# Altium schematic sheet Power.SchDoc
size B; SheetNumber: 2; SheetTotal: 8
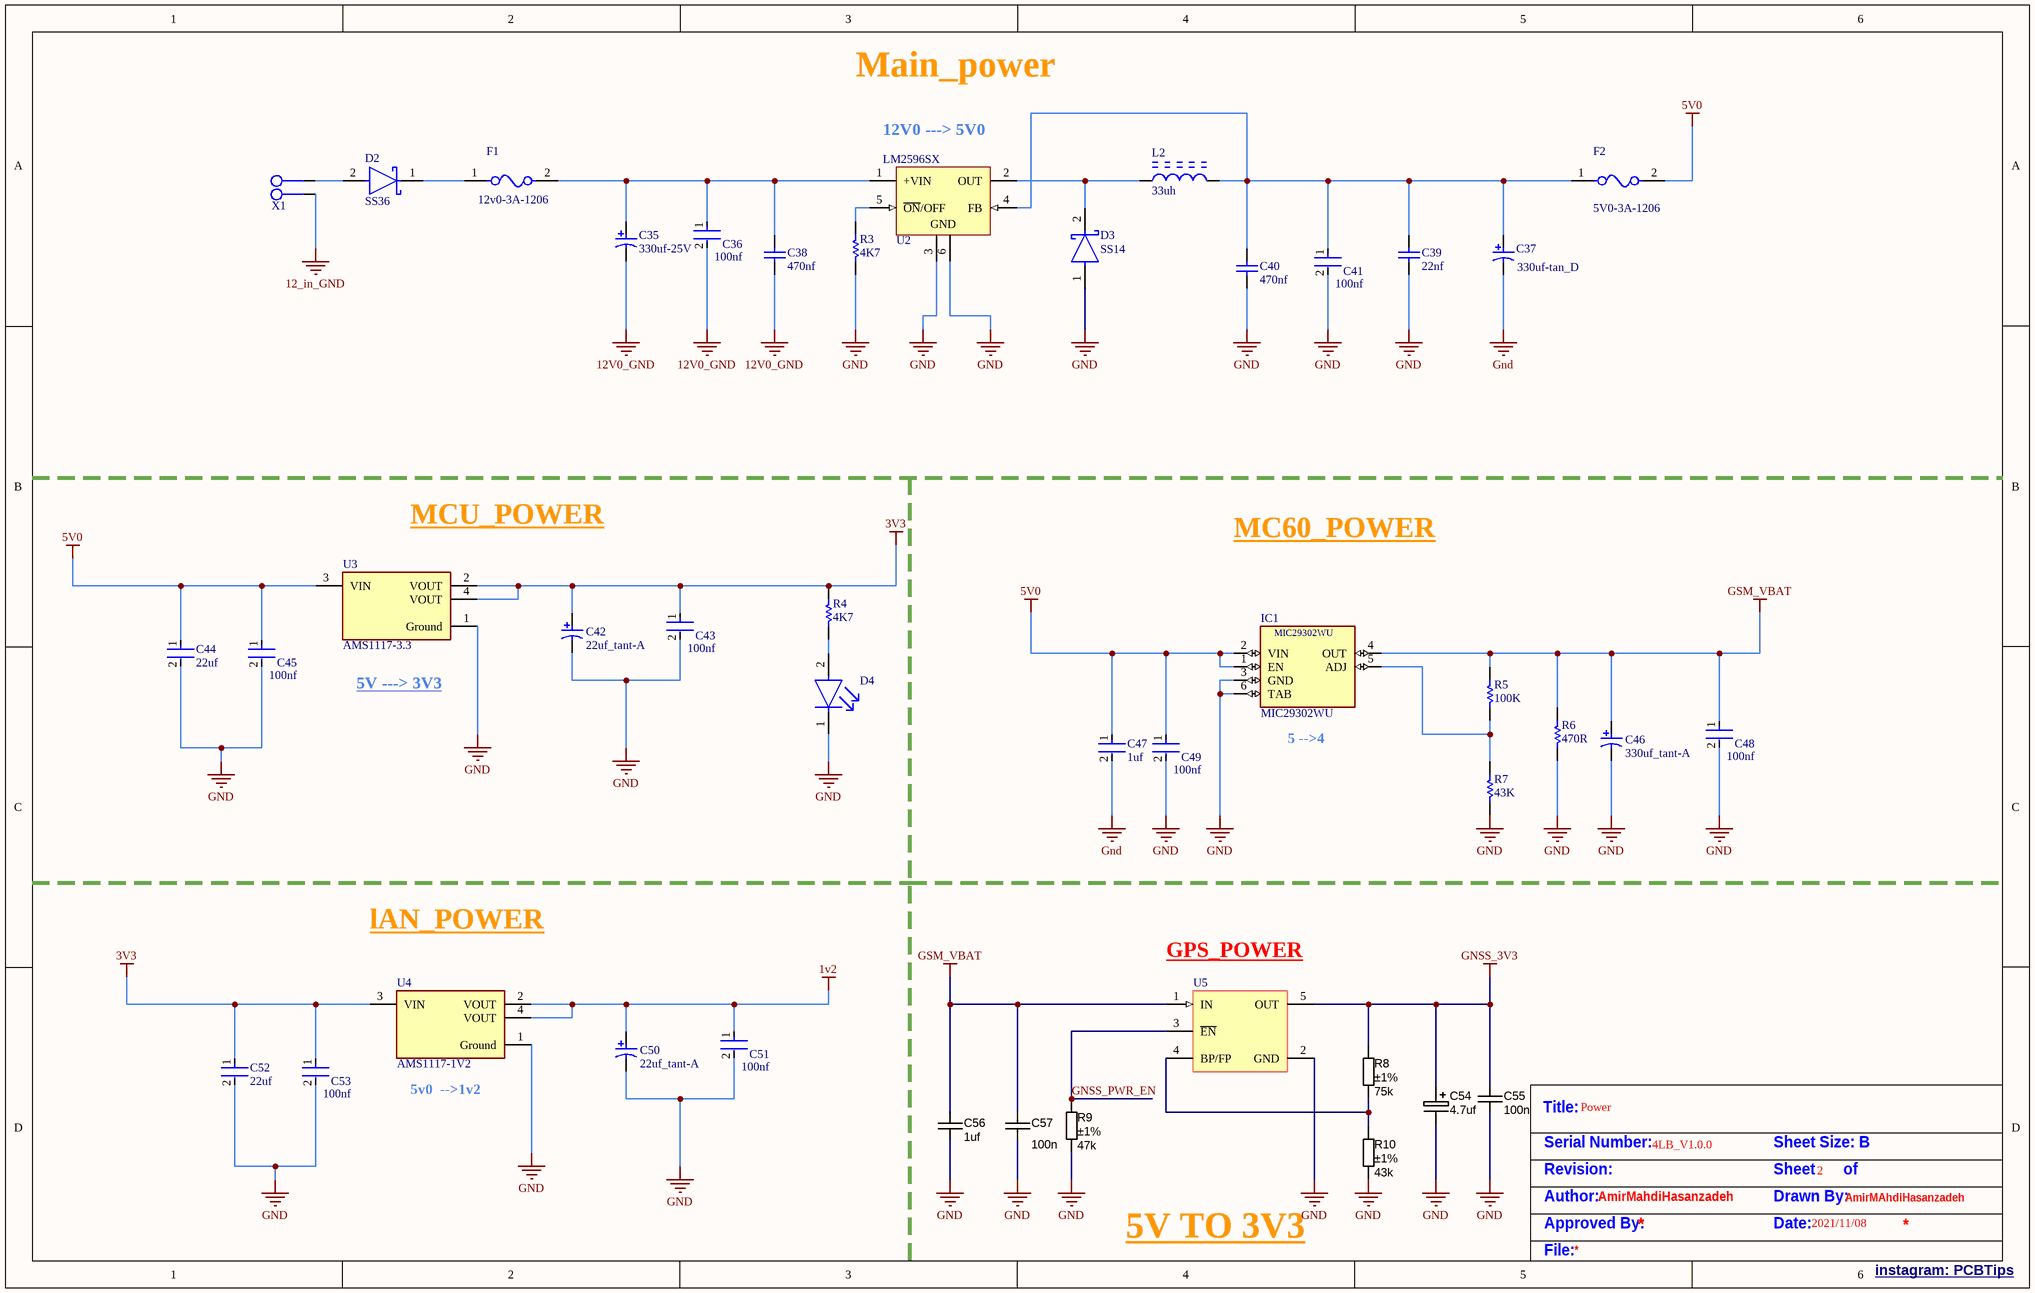
[diagram p0: Power.SchDoc]

## Parts
C35  330uf-25V  [NIC-CAPA2-8X10_V]
C36  100nf  [FP-CGA3E-0_3-0_1-IPC_A]
C37  330uf-tan_D  [CAPMP7344X31-T_V]
C38  470nf  [CAPC3216X125X55LL15T25]
C39  22nf  [CAPC1608X90X35ML10T15]
C40  470nf  [CAPC3216X125X55LL15T25]
C41  100nf  [FP-CGA3E-0_3-0_1-IPC_A]
C42  22uf_tant-A  [AVX-TPSA106K010R1800_M]
C43  100nf  [FP-CGA3E-0_3-0_1-IPC_A]
C44  22uf  [FP-GRM31C-0_2-e0_3_0_8-MFG]
C45  100nf  [FP-CGA3E-0_3-0_1-IPC_A]
C46  330uf_tant-A  [AVX-TPSA106K010R1800_M]
C47  1uf  [FP-0603-L_1_6_0_1-W_0_8_0-IPC_A]
C48  100nf  [FP-CGA3E-0_3-0_1-IPC_A]
C49  100nf  [FP-CGA3E-0_3-0_1-IPC_A]
C50  22uf_tant-A  [AVX-TPSA106K010R1800_M]
C51  100nf  [FP-CGA3E-0_3-0_1-IPC_A]
C52  22uf  [FP-GRM31C-0_2-e0_3_0_8-MFG]
C53  100nf  [FP-CGA3E-0_3-0_1-IPC_A]
C54  4.7uf  [C_TN_3216]
C55  value 100n  [CAPC1608X90N]  (hidden comment: approved sub OK)
C56  1uf  [CAPC1608X90N]
C57  100n  [CAPC1608X90N]
D2  SS36  [FP-403AG-MFG]
D3  SS14  [FP-403AE-MFG]
D4  LTST-C191TBKT  [FP-LTST-C191TBKT-MFG]  (value not drawn)
F1  12v0-3A-1206  [FP-nanoSMDC-MFG]
F2  5V0-3A-1206  [FP-nanoSMDC-MFG]
IC1  MIC29302WU  [TO263-5]
L2  33uh  [BOUR-SRR1280-2_V]
R3  4K7  [RESC1608X55X25ML10T15]
R4  4K7  [RESC1608X55X25ML10T15]
R5  100K  [RESC1608X55X25ML10T15]
R6  470R  [RESC1608X55X25ML10T15]
R7  43K  [RESC1608X55X25ML10T15]
R8  value 75k  Tolerance: ±1%  [RESC1608X55N]  (hidden comment: Thick Film)
R9  value 47k  Tolerance: ±1%  [RESC1608X55N]  (hidden comment: Thick Film)
R10  value 43k  Tolerance: ±1%  [RESC1608X55N]  (hidden comment: Thick Film)
U2  LM2596SX  [KTT0005B_L]
U3  AMS1117-3.3  [FP-AMS1117-IPC_C]
U4  AMS1117-1V2  [FP-AMS1117-IPC_C]
U5  (no value)  [SOT95P280X100-5N]
X1  Phoenix MKDSN 02  [GMSTB762_2]  (value not drawn)

## Nets
1v2: C50.1 C51.1 U4.2(VOUT) U4.4(VOUT)
3V3: C42.1 C43.1 C52.1 C53.1 R4.2 U3.2(VOUT) U3.4(VOUT) U4.3(VIN)
5V0: C44.1 C45.1 C47.1 C49.1 F2.2 IC1.1(EN) IC1.2(VIN) U3.3(VIN)
12_in_GND: X1.1
12V0_GND: C35.2 C36.2 C38.1
GND: C37.2 C39.1 C40.1 C41.2 C42.2 C43.2 C44.2 C45.2 C46.2 C47.2 C48.2 C49.2 C50.2 C51.2 C52.2 C53.2 C54.2 C55.2 C56.2 C57.2 D3.1(A) D4.1(C) IC1.3(GND) IC1.6(TAB) R3.1 R6.1 R7.1 R9.2 R10.2 U2.3(GND) U2.6(GND) U3.1(Ground) U4.1(Ground) U5.2(GND)
GNSS_3V3: C54.1 C55.1 R8.1 U5.5(OUT)
GSM_VBAT: C46.1 C48.1 C56.1 C57.1 IC1.4(OUT) R5.2 R6.2 U5.1(IN)
GNSS_PWR_EN: R9.1 U5.3(~{EN})
NetC35_1: C35.1 C36.1 C38.2 F1.2 U2.1(+VIN)
NetC37_1: C37.1 C39.2 C40.2 C41.1 F2.1 L2.2 U2.4(FB)
NetD2_1: D2.1(C) F1.1
NetD2_2: D2.2(A) X1.2
NetD3_2: D3.2(C) L2.1 U2.2(OUT)
NetD4_2: D4.2(A) R4.1
NetIC1_5: IC1.5(ADJ) R5.1 R7.2
NetR3_2: R3.2 U2.5(~{ON}/OFF)
NetR8_2: R8.2 R10.1 U5.4(BP/FP)

## Notes on the sheet
- Main_power
- (near U2) 12V0 ---> 5V0
- MCU_POWER
- MC60_POWER
- (near U3) 5V ---> 3V3
- (near IC1) 5 -->4
- lAN_POWER
- (near U5) GPS_POWER
- (near U4) 5v0  -->1v2
- 5V TO 3V3
- Title:
- Power
- Serial Number:
- Revision:
- 4LB_V1.0.0
- Sheet       of
- Sheet Size: B
- 2
- Author:
- Approved By:
- AmirMahdiHasanzadeh
- Date:
- Drawn By:
- 2021/11/08
- AmirMAhdiHasanzadeh
- File:
- instagram: PCBTips <https://www.instagram.com/pcbtips>

## Library data of the parts
C35 = CMP-0687-00068-1: Aluminum Electrolytic Capacitor, UD Series, Low Impedance, 330 uF, 25 V, + / - 20%, -55 to 105 degC, Chip Type, 8 x 10 mm D x L, Pb-Free, Reel; PartNumber: UUD1E331MNL1GS; Manufacturer: Nichicon; Rated Voltage: 25 V; Tolerance Rated Capacitance: -20 to 20%; Packing: Dia382mm Reel; Impedance: 0.17 Ohm; Rated Ripple Current (at 100kHz): 450 mA; Endurance Time: 5000 h; Rated Capacitance: 330 uF; ComponentLink3URL: http://products.nichicon.co.jp/en/pdf/XJA043/e-ud.pdf; PackageDescription: 2-Pin Surface Mount Device, Diameter 8 mm, Height 10 mm, Pitch 6.5 mm; ComponentLink1URL: http://www.nichicon.co.jp/; PackageReference: CAPAE-D8H10; ComponentLink1Description: Manufacturer URL; ComponentLink2Description: Datasheet; DatasheetVersion: 08/2012; RoHS: TRUE; Diameter: 8 mm; Mounting Technology: Surface Mount; ComponentLink2URL: http://products.nichicon.co.jp/en/pdf/XJA043/e-ud.pdf; ComponentLink3Description: Package Specification; Length: 10 mm
C36 C41 C43 C45 C48 C49 C51 C53 = CMP-2000-07546-2: Cap Ceramic 100nF 50V X7R 10% Pad SMD 0603 +125°C Automotive T/R; Weight: 7.1E-05oz; Composition: Ceramic; Max Operating Temperature: 125°C; Termination: SMD/SMT; Dielectric: X7R; Length: 1.6mm; Package Quantity: 1; REACH SVHC: No SVHC; Lead Free: Lead Free; Case Code (Metric): 1608; Min Operating Temperature: -55°C; Packaging: Tape and Reel; Tolerance: 10%; Voltage Rating: 50V; Case Code (Imperial): 0603; Capacitance: 100nF; Case/Package: 0603; Voltage Rating (DC): 50V; Depth: 0.8mm; Radiation Hardening: No; Ratings: AEC-Q200; Mount: Surface Mount; Voltage: 50V; Thickness: 0.035inch; Width: 0.8mm; Height: 0.8mm
C37 = CMP-2000-07305-1: Low ESR, 330 uF, 6.3 V, +/- 10%, -55 to 125 degC, 2-Pin SMD, RoHS, Tape and Reel; Manufacturer: AVX; Rad Hardened: No; DF: 8%; Capacitance: 330000000pF; Product Depth (mm): 4.3mm; Wire Form: NotRequired; Lead Spacing (nom): NotRequiredmm; Case Style: Molded; Product Length (mm): 7.3mm; Voltage: 6.3VDC; DCL: 20.8uA; ESR: 0.05ohm; Product Height (mm): 2.9mm; Polarity: Polar; Datasheet URL: http://datasheets.avx.com/TPS.pdf; Mounting Style: SurfaceMount; Length W/Weld (max): NotRequiredmm; Construction: SMTChip; Package / Case: 7343-31; Product Diameter (mm): NotRequiredmm; Mounting Technology: SurfaceMount; Insulation: NotRequired; Operating Temp Range: -55Cto125C; Tolerance (+ or -): 10%; Failure Rate: NotRequired; Package URL: http://www.avx.com/download/software/literature/AVX-Footprint-Library.pdf; Packaging: TapeandReel; Case Code: D; Length W/Weld: NotRequiredmm; Manufacturer URL: http://www.avx.com/; Datasheet Version: 01/2017; Package Reference: CAPMP7344X31-T; Seated Plane Height: NotRequiredmm; Seal: NotRequired; Package Description: 2-Pin Surface Mount Device, Body 7.3 x 4.35 mm
C38 C40 = CMP-1037-04569-2: Chip Capacitor, 0.47 uF, +/- 10%, 50 V, -55 to 125 degC, 1206 (3216 Metric), RoHS, Tape and Reel; Manufacturer: Murata; Voltage Rating: 50V; Capacitance: 0.47uF; Case Height: 1.15mm; Temperature Coefficient / Code: +/-15%; Case Length: 3.2mm; Type: GeneralPurposeMLCC; Case Width: 1.6mm; Dielectric: X7R; Brand: MurataElectronics; Capacitance - pF: 470000pF; Dimensions: 1.6mmWx3.2mmLx1.15mmH; Product: GeneralTypeMLCCs; Minimum Operating Temperature: -55C; Packaging: Reel; Case Code - in: 1206; Package Reference: 1206; Tolerance: 10%; Case Code - mm: 3216; RoHS: Details; Series: GRM; Termination Style: SMD/SMT; Datasheet URL: http://psearch.en.murata.com/capacitor/product/GRM31MR71H474KA01%23.pdf?graph=c1f26abc89b3cfcebdb62922f5769d77; Capacitance - nF: 470nF; Voltage Rating DC: 50V; Product Category: MultilayerCeramicCapacitorsMLCC-SMD/SMT; Datasheet Version: 10/2016; Package / Case: 1206(3216metric); Maximum Operating Temperature: +125C; Mounting Technology: SurfaceMount; Operating Temperature Range: -55Cto+125C; Factory Pack Quantity: 3000; Manufacturer URL: http://www.murata.com/; Package Description: 2-Pin Surface Mount Device, Body 3.2 x 1.6 mm
C39 = CMP-2006-02910-1: Manufacturer: Murata; Part Number: GRM188R71H223KA01D
C42 C50 = CMP-2000-07288-1: Tantalum Capacitor, 22uF, +/- 10%, 10 V, -55 to 125 degC, 2-Pin Molded, RoHS, Tape and Reel; Manufacturer: AVX; Manufacturer Size Code: A; Online Catalog: TPSSeries; Other Names: 478-3317-1; Kits: 478-3444-ND-KITTANTCAPTPSSERIES; ESR (Equivalent Series Resistance): 1.8Ohm; Catalog Drawings: TPSSeriesSides; Product Training Modules: ComponentSolutionsforSmartMeterApplications; Voltage - Rated: 10V; EDA / CAD Models: DownloadfromAcceleratedDesigns; Featured Product: TPSCapacitors; Capacitance: 10µF; Mounting Type: SurfaceMount; Packaging: CutTape(CT); Package Reference: TPSA106K010R1800; Size / Dimension: 0.126"Lx0.063"W(3.20mmx1.60mm); Package / Case: 1206(3216Metric); Mounting Technology: SurfaceMount; Family: TantalumCapacitors; Manufacturer URL: http://www.avx.com/; Datasheet URL: http://www.farnell.com/datasheets/1441576.pdf; Datasheet Version: 03/2011; Height - Seated (Max): 0.071"(1.80mm); Type: Molded; Features: GeneralPurpose; Lifetime @ Temp.: -; Lead Spacing: -; Standard Package: 1; Package Description: 2-Pin Surface Mount Device, Body 3.2 x 1.65 mm; Tolerance: ±10%; Category: Capacitors; Operating Temperature: -55°C~125°C; Series: TPS
C44 C52 = CMP-06035-003841-1: Chip Multilayer Ceramic Capacitors for General Purpose, 1206, 22uF, X7R, 15%, 10%, 10V; Height: 1.6mm; Width: 0.063inch; Min Operating Temperature: -55°C; Package Quantity: 1; Termination: SMD/SMT; Length: 3.2mm; Voltage Rating: 10V; Case/Package: 1206; Capacitance: 22uF; Case Code (Imperial): 1206; Depth: 1.6mm; Dielectric: X7R; Voltage: 10V; Material: Ceramic; Tolerance: 10%; Voltage Rating (DC): 10V; Lead Free: Lead Free; Max Operating Temperature: 125°C; Case Code (Metric): 3216; Packaging: Tape and Reel; Thickness: 0.071inch; Radiation Hardening: No; REACH SVHC: No SVHC; Mount: Surface Mount
C46 = CMP-2000-07288-1: Tantalum Capacitor, 330uF, +/- 10%, 10 V, -55 to 125 degC, 2-Pin Molded, RoHS, Tape and Reel; Manufacturer: AVX; Manufacturer Size Code: A; Online Catalog: TPSSeries; Other Names: 478-3317-1; Kits: 478-3444-ND-KITTANTCAPTPSSERIES; ESR (Equivalent Series Resistance): 1.8Ohm; Catalog Drawings: TPSSeriesSides; Product Training Modules: ComponentSolutionsforSmartMeterApplications; Voltage - Rated: 10V; EDA / CAD Models: DownloadfromAcceleratedDesigns; Featured Product: TPSCapacitors; Capacitance: 10µF; Mounting Type: SurfaceMount; Packaging: CutTape(CT); Package Reference: TPSA106K010R1800; Size / Dimension: 0.126"Lx0.063"W(3.20mmx1.60mm); Package / Case: 1206(3216Metric); Mounting Technology: SurfaceMount; Family: TantalumCapacitors; Manufacturer URL: http://www.avx.com/; Datasheet URL: http://www.farnell.com/datasheets/1441576.pdf; Datasheet Version: 03/2011; Height - Seated (Max): 0.071"(1.80mm); Type: Molded; Features: GeneralPurpose; Lifetime @ Temp.: -; Lead Spacing: -; Standard Package: 1; Package Description: 2-Pin Surface Mount Device, Body 3.2 x 1.65 mm; Tolerance: ±10%; Category: Capacitors; Operating Temperature: -55°C~125°C; Series: TPS
C47 = CMP-2000-05447-3: None; Tolerance: 10%; Voltage Rating: 50V; Dielectric: X5R; Height: 0.8mm; Depth: 0.8mm; Number of Pins: 2; Length: 1.6mm; Thickness: 0.035inch; Contact Plating: Nickel; Radiation Hardening: No; Package Quantity: 1; Case/Package: 0603; Capacitance: 1uF; Halogen Free: Halogen Free; RoHS Compliant: Yes; Termination: SMD/SMT; Max Operating Temperature: 85°C; Min Operating Temperature: -55°C; Case Code (Metric): 1608; Construction: Flat; Voltage Rating (DC): 50V; Packaging: Tape and Reel; Series: M; Case Code (Imperial): 0603; Width: 0.031inch; Mount: Surface Mount
C54 = CAPT_330u_2917_6V3: Capacitor SMD Tant 4.7uF 20% 6V3 2917; Manufacturer Size Code: D; Manufacturer Part Number: T520D337M006ATE015; Ratings: 6.3V; Material: Solid Tantalum; ESR (Equivalent Series Resistance): 15 mOhm; SCDType: spec; Package / Case: 2917 (7343 Metric); Tolerance: ±20%; Operating Temperature: -55°C ~ 125°C; Size / Dimension: 0.287" L x 0.169" W (7.30mm x 4.30mm); Height - Seated (Max): 0.122" (3.10mm); Supplier 1: Digi-Key; Supplier Part Number 1: 399-4052-1-ND; ComponentLink1URL: http://www.kemet.com/datasheets&T520D337M006ATE015; ComponentLink1Description: T520D Datasheet; Value: 4.7uf
C55 = CAPC_100n_0603_X7R_50V_10%: Capacitor SMD Cer 100nF 10% 50V X7R 0603; Manufacturer 1: AVX Corporation; Manufacturer Part Number 1: 06035C104KAT2A; Ratings: 50V; X7R; Material: ceramic; SCDType: spec; Manufacturer 2: TDK Corporation; Manufacturer Part Number 2: C1608X7R1H104K; Package / Case: 0603 (1608 Metric); Tolerance: ±10%; Supplier 1: Digi-Key; Supplier Part Number 1: 478-5052-1-ND; ComponentLink1URL: http://www.avx.com/docs/Catalogs/cx7r.pdf; ComponentLink1Description: http://www.avx.com/docs/Catalogs/cx7r.pdf; Supplier 2: Digi-Key; Supplier Part Number 2: 445-1314-1-ND; ComponentLink2URL: http://product.tdk.com/capacitor/mlcc/en/documents/mlcc_commercial_general_en.pdf; ComponentLink2Description: http://product.tdk.com/capacitor/mlcc/en/documents/mlcc_commercial_general_en.pdf
C56 = CAPC_470n_0603_X7R_16V_10%: Capacitor SMD Cer 1uf 10% 16V X7R 0603; Manufacturer 1: Murata Electronics North America; Manufacturer Part Number 1: GRM188R71C474KA88D; Ratings: 16V; X7R; Material: ceramic; SCDType: spec; Package / Case: 0603 (1608 metric); Tolerance: ±10%; Manufacturer 2: TDK Corporation; Manufacturer Part Number 2: C1608X7R1C474K; Supplier 1: Digi-Key; Supplier Part Number 1: 490-3295-2-ND; Supplier 2: Digi-Key; Supplier Part Number 2: 445-5192-2-ND; Supplier 3: Digi-Key; Supplier Part Number 3: 587-1250-2-ND; Manufacturer 3: Taiyo Yuden; Manufacturer Part Number 3: EMK107B7474KA-T; Manufacturer 4: Samsung; Manufacturer Part Number 4: CL10B474KONE; ComponentLink1URL: http://psearch.murata.com/capacitor/product/GRM188R71C474KA88#.pdf; ComponentLink1Description: http://psearch.murata.com/capacitor/product/GRM188R71C474KA88#.pdf; ComponentLink2URL: http://product.tdk.com/capacitor/mlcc/en/documents/mlcc_commercial_general_en.pdf; ComponentLink2Description: http://product.tdk.com/capacitor/mlcc/en/documents/mlcc_commercial_general_en.pdf; ComponentLink3URL: http://www.yuden.co.jp/or/product/category/capacitor/EMK107B7474KA-T.pdf; ComponentLink3Description: http://www.yuden.co.jp/or/product/category/capacitor/EMK107B7474KA-T.pdf; Value: 1uf
C57 = CAPC_470n_0603_X7R_16V_10%: Capacitor SMD Cer 100nF 10% 16V X7R 0603; Manufacturer 1: Murata Electronics North America; Manufacturer Part Number 1: GRM188R71C474KA88D; Ratings: 16V; X7R; Material: ceramic; SCDType: spec; Package / Case: 0603 (1608 metric); Tolerance: ±10%; Manufacturer 2: TDK Corporation; Manufacturer Part Number 2: C1608X7R1C474K; Supplier 1: Digi-Key; Supplier Part Number 1: 490-3295-2-ND; Supplier 2: Digi-Key; Supplier Part Number 2: 445-5192-2-ND; Supplier 3: Digi-Key; Supplier Part Number 3: 587-1250-2-ND; Manufacturer 3: Taiyo Yuden; Manufacturer Part Number 3: EMK107B7474KA-T; Manufacturer 4: Samsung; Manufacturer Part Number 4: CL10B474KONE; ComponentLink1URL: http://psearch.murata.com/capacitor/product/GRM188R71C474KA88#.pdf; ComponentLink1Description: http://psearch.murata.com/capacitor/product/GRM188R71C474KA88#.pdf; ComponentLink2URL: http://product.tdk.com/capacitor/mlcc/en/documents/mlcc_commercial_general_en.pdf; ComponentLink2Description: http://product.tdk.com/capacitor/mlcc/en/documents/mlcc_commercial_general_en.pdf; ComponentLink3URL: http://www.yuden.co.jp/or/product/category/capacitor/EMK107B7474KA-T.pdf; ComponentLink3Description: http://www.yuden.co.jp/or/product/category/capacitor/EMK107B7474KA-T.pdf; Value: 100n
D2 = CMP-07162-000004-1: DIODE SCHOTTKY 60V 3A SMC; Manufacturer: ON Semiconductor; Max Junction Temp: +150°C; Max Surge Forward Current: 100A; Standoff Height: 0.05mm; Peak Reverse Current: 0.5mA; Manufacturer Part Number: SS36; Category: Diode; Device Class L2: Diodes; Lead Free: Yes; Mouser Description: In a Pack of 25, ON Semi 60V 3A, Schottky Diode, 2-Pin DO-214AB SS36; Automotive: No; Package: 403AG; Device Class L3: Schottky Diodes; Footprint Url: https://www.onsemi.com/pub/Collateral/403AG.PDF; Temperature: -55°C to +150°C; ComponentLink2URL: https://www.onsemi.com/pub/Collateral/SS39-D.PDF; Max Repetitive Reverse Voltage: 60V; Octopart: https://octopart.com/ss36-on+semiconductor-84331627; Temperature Range Low: -55°C; Forward Current: 3A; Device Class L1: Discrete Semiconductors; Digikey Description: DIODE SCHOTTKY 60V 3A SMC; RoHS: TRUE; Temperature Range High: +150°C; ComponentLink2Description: Datasheet; Height: 2.65mm
D3 = CMP-2000-04943-2: DIODE SCHOTTKY 40V 1A SMA; Manufacturer: ON Semiconductor; Peak Reverse Current: 0.2mA; Max Junction Temp: +125°C; Standoff Height: 0.05mm; Max Surge Forward Current: 40A; Mouser Description: Schottky Diodes & Rectifiers SMA 40V 1.0A; RoHS: TRUE; Lead Free: Yes; Manufacturer Part Number: SS14; Device Class L3: Schottky Diodes; Category: Diode; Automotive: No; Digikey Description: DIODE SCHOTTKY 40V 1A SMA; ComponentLink2Description: Datasheet; Device Class L2: Diodes; Height: 2.5mm; Temperature Range High: +125°C; ComponentLink2URL: https://www.onsemi.com/pub/Collateral/SS19-D.PDF; Device Class L1: Discrete Semiconductors; Package: 403AE; Octopart: https://octopart.com/ss14-on+semiconductor-29205033; Max Repetitive Reverse Voltage: 40V; Temperature Range Low: -65°C; Forward Current: 1A; Temperature: -65°C to +125°C
D4 = CMP-22017-000008-1: LED BLUE CLEAR CHIP SMD; Lens Color: Colorless; Dominant Wavelength: 475nm; Forward Current: 20mA; Wavelength: 468nm; Viewing Angle: 130°; Power Dissipation: 76mW; Luminous Intensity: 180mcd; Reverse Voltage: 5V; Number of Elements: 1; Lens Style: Diffused; Forward Voltage: 3.8V; Max Power Dissipation: 75mW; Case Code (Metric): 1608; Packaging: Tape and Reel; Case/Package: 0603; Depth: 1.6mm; Mount: Surface Mount; Lead Free: Lead Free; Min Operating Temperature: -20°C; Lens Transparency: Clear; Illumination Color: Blue; Height: 0.55mm; Test Current: 20mA; Case Code (Imperial): 0603; Max Operating Temperature: 80°C; Number of Pins: 2; Length: 0.8mm; Radiation Hardening: No; Package Quantity: 1; Number of LEDs: 1; Width: 0.8mm; Color: Blue
F1 F2 = CMP-08606-000049-1: PTC RESET FUSE 48V 120MA 1206; Manufacturer: Littelfuse; Manufacturer Part Number: NANOSMDC012F-2; Trip Current: 0.39A; Resistance: 1.4-6.5Ω; Value: 1.4-6.5Ω; Current Rating: 10A; Hold Current: 0.12A; Trip Time: 0.2s; Category: Fuse; Device Class L2: PTC Resettable Fuses; ComponentLink2Description: Datasheet; Automotive: No; Package: nanoSMDC; Ambient Temperature Range Low: -40°C; Lead Free: Yes; Voltage Rating: 48V; Mouser Description: PTC Resettable Fuse 0.12A(hold) 0.39A(trip) 48VDC 10A 0.5W 0.2s 1.4Ohm SMD Solder Pad 1206 T/R Automotive; Octopart: https://octopart.com/nanosmdc012f-2-littelfuse-74215047; Device Class L1: Circuit Protection; Temperature Range High: +85°C; ComponentLink2URL: https://www.littelfuse.com/~/media/electronics/datasheets/resettable_ptcs/littelfuse_ptc_nanosmdc_datasheet.pdf.pdf; Temperature: to +85°C; Height: 1mm; Ambient Temperature Range High: +85°C; Digikey Description: PTC RESET FUSE 48V 120MA 1206; Device Class L3: unset; RoHS: TRUE
IC1 = MIC29302WU: Linear Voltage Regulator IC 1 Output 3A TO-263-5; MF: Microchip Technology; Package: TO-263-6 Microchip Technology; Price: None; MP: MIC29302WU; Availability: Unavailable; SnapEDA_Link: https://www.snapeda.com/parts/MIC29302WU/Microchip/view-part/4422516/?ref=snap; Value: *
L2 = CMP-2000-07148-1: Shielded SMD Power Inductor, 33 uH, +/- 20%, -40 to 125 degC, 2-Pin SMD, RoHS, Tape and Reel; Manufacturer: Bourns; PartNumber: SRR1280; DC Resistance Max: 57MOhm; Maximum Self Resonant Frequency: 9.5MHz; DC Current Max: 3.5A; Inductance: 33000nH; Core Material: Ferrite; Minimum Quality Factor: 28; Maximum DC Resistance: 57mΩ; Datasheet Version: Rev. 03/15, 03/2015; Manufacturer URL: http://www.bourns.com/; Datasheet URL: http://www.bourns.com/docs/Product-Datasheets/SRR1280.pdf; Minimum Operating Temperature: -40°C; Package Description: 2-Pin Surface Mount Device, Body 12.5 x 12.5 mm; Maximum Operating Temperature: +125°C; Tolerance: 20%; Series: SRR1280; Package URL: http://www.bourns.com/docs/Product-Datasheets/SRR1280.pdf; Package Reference: SRR1280-2; Mounting Technology: SurfaceMount; Maximum DC Current: 3.5A
R3 R4 = CMP-2100-03667-1: Chip Resistor, 0 Ohm, +/- 5%, 0.1 W, -55 to 155 degC, 0603 (1608 Metric), RoHS, Tape and Reel; Manufacturer: Yageo; Temperature Coefficient: 200ppm/degreesC; Voltage Rating: 50V; Power Rating: 100mW; Resistance: 0mOhm; Width: 0.8mm; Max Operating Temperature: 155degC; Tolerance: 5%; Package Reference: 0603; Height: 0.45mm; Depth: 0.8mm; Package Description: 2-Pin Surface Mount Device, Body 1.6 x 0.8 mm; Termination: SMD/SMT; Package Quantity: 5000; Case/Package: 0603; Case Code (Imperial): 0603; Radiation Hardening: No; Number of Pins: 2; Length: 1.6mm; Lead Free: LeadFree; Voltage Rating (DC): 50V; Military Standard: Not; Datasheet URL: http://www.yageo.com/NewPortal/yageodocoutput?fileName=/pdf/R-Chip/PYu-RC_Group_51_RoHS_L_5.pdf; Manufacturer URL: http://www.yageo.com/; Packaging: TapeandReel; Case Code (Metric): 1608; Min Operating Temperature: -55degC; Composition: ThickFilm; RoHSCompliant: true; Contact Plating: Tin; Datasheet Version: Rev. 5, 10/2016; REACH SVHC: NoSVHC
R5 = CMP-2100-03667-1: Chip Resistor, 100K Ohm, +/- 5%, 0.1 W, -55 to 155 degC, 0603 (1608 Metric), RoHS, Tape and Reel; Manufacturer: Yageo; Temperature Coefficient: 200ppm/degreesC; Voltage Rating: 50V; Power Rating: 100mW; Resistance: 0mOhm; Width: 0.8mm; Max Operating Temperature: 155degC; Tolerance: 5%; Package Reference: 0603; Height: 0.45mm; Depth: 0.8mm; Package Description: 2-Pin Surface Mount Device, Body 1.6 x 0.8 mm; Termination: SMD/SMT; Package Quantity: 5000; Case/Package: 0603; Case Code (Imperial): 0603; Radiation Hardening: No; Number of Pins: 2; Length: 1.6mm; Lead Free: LeadFree; Voltage Rating (DC): 50V; Military Standard: Not; Datasheet URL: http://www.yageo.com/NewPortal/yageodocoutput?fileName=/pdf/R-Chip/PYu-RC_Group_51_RoHS_L_5.pdf; Manufacturer URL: http://www.yageo.com/; Packaging: TapeandReel; Case Code (Metric): 1608; Min Operating Temperature: -55degC; Composition: ThickFilm; RoHSCompliant: true; Contact Plating: Tin; Datasheet Version: Rev. 5, 10/2016; REACH SVHC: NoSVHC
R6 = CMP-2100-03667-1: Chip Resistor, 470Ohm, +/- 5%, 0.1 W, -55 to 155 degC, 0603 (1608 Metric), RoHS, Tape and Reel; Manufacturer: Yageo; Temperature Coefficient: 200ppm/degreesC; Voltage Rating: 50V; Power Rating: 100mW; Resistance: 0mOhm; Width: 0.8mm; Max Operating Temperature: 155degC; Tolerance: 5%; Package Reference: 0603; Height: 0.45mm; Depth: 0.8mm; Package Description: 2-Pin Surface Mount Device, Body 1.6 x 0.8 mm; Termination: SMD/SMT; Package Quantity: 5000; Case/Package: 0603; Case Code (Imperial): 0603; Radiation Hardening: No; Number of Pins: 2; Length: 1.6mm; Lead Free: LeadFree; Voltage Rating (DC): 50V; Military Standard: Not; Datasheet URL: http://www.yageo.com/NewPortal/yageodocoutput?fileName=/pdf/R-Chip/PYu-RC_Group_51_RoHS_L_5.pdf; Manufacturer URL: http://www.yageo.com/; Packaging: TapeandReel; Case Code (Metric): 1608; Min Operating Temperature: -55degC; Composition: ThickFilm; RoHSCompliant: true; Contact Plating: Tin; Datasheet Version: Rev. 5, 10/2016; REACH SVHC: NoSVHC
R7 = CMP-2100-03667-1: Chip Resistor, 47KOhm, +/- 5%, 0.1 W, -55 to 155 degC, 0603 (1608 Metric), RoHS, Tape and Reel; Manufacturer: Yageo; Temperature Coefficient: 200ppm/degreesC; Voltage Rating: 50V; Power Rating: 100mW; Resistance: 0mOhm; Width: 0.8mm; Max Operating Temperature: 155degC; Tolerance: 5%; Package Reference: 0603; Height: 0.45mm; Depth: 0.8mm; Package Description: 2-Pin Surface Mount Device, Body 1.6 x 0.8 mm; Termination: SMD/SMT; Package Quantity: 5000; Case/Package: 0603; Case Code (Imperial): 0603; Radiation Hardening: No; Number of Pins: 2; Length: 1.6mm; Lead Free: LeadFree; Voltage Rating (DC): 50V; Military Standard: Not; Datasheet URL: http://www.yageo.com/NewPortal/yageodocoutput?fileName=/pdf/R-Chip/PYu-RC_Group_51_RoHS_L_5.pdf; Manufacturer URL: http://www.yageo.com/; Packaging: TapeandReel; Case Code (Metric): 1608; Min Operating Temperature: -55degC; Composition: ThickFilm; RoHSCompliant: true; Contact Plating: Tin; Datasheet Version: Rev. 5, 10/2016; REACH SVHC: NoSVHC
R8 = RES_1K_0603_1%: Resistor SMD chip 75k Ohm 0.1W 1% 0603; Manufacturer 1: Yageo; Manufacturer Part Number 1: RC0603FR-071KL; Ratings: 1/10W; SCDType: spec; Package / Case: 0603 (1608 Metric); Supplier 1: Digi-Key; Supplier Part Number 1: 311-1.00KHRCT-ND
R9 = RES_1K_0603_1%: Resistor SMD chip 47k Ohm 0.1W 1% 0603; Manufacturer 1: Yageo; Manufacturer Part Number 1: RC0603FR-071KL; Ratings: 1/10W; SCDType: spec; Package / Case: 0603 (1608 Metric); Supplier 1: Digi-Key; Supplier Part Number 1: 311-1.00KHRCT-ND
R10 = RES_1K_0603_1%: Resistor SMD chip 43k Ohm 0.1W 1% 0603; Manufacturer 1: Yageo; Manufacturer Part Number 1: RC0603FR-071KL; Ratings: 1/10W; SCDType: spec; Package / Case: 0603 (1608 Metric); Supplier 1: Digi-Key; Supplier Part Number 1: 311-1.00KHRCT-ND
U2 = CMP-2000-06545-1: Simple Switcher(R) Power Converter 150 kHz Step-Down Voltage Regulator, 3 A, 4.5 to 40 V, -40 to 125 degC, 5-Pin TO-263 (KTT), Green (RoHS & no Sb/Br), Tape and Reel; PartNumber: LM2596; Manufacturer: Texas Instruments; Package Version: 4200577-4/G, 01/2013; Primary Input Voltage: 40V; No. of Outputs: 1; No. of Pins: 5; SVHC: NoSVHC(19-Dec-2012); Output Voltage: 37V; Output Current: 3A; Datasheet Version: Rev. C, 04/2013; Package Reference: KTT5; MSL: MSL3-168hours; Number of Outputs: 1; Operating Temperature Min: -40°C; Operating Temperature Range: -40°Cto+125°C; Manufacturer URL: http://www.ti.com/; Package URL: http://www.ti.com/litv/pdf/mpsf007e; Voltage Regulator Case Style: TO-263; Operating Temperature Max: 125°C; Package Description: 5-Pin Plastic Flange Mount, Body 10.16 x 8.925 mm, Pitch 1.7 mm; Datasheet URL: http://www.ti.com/lit/ds/symlink/lm2596.pdf; Mounting Technology: SurfaceMount
U3 = CMP-209535-000001-1: LDO Voltage Regulators 1A, 3.3V; Manufacturer: Advanced Monolithic Systems; Dropout Voltage: 1.1V; Output Type: Fixed; Nominal Supply Current: 5mA; Max Power Dissipation: 1.2W; Max Supply Voltage: 15V; Number Of Outputs: 1; Standoff Height: 0.64mm; Max Junction Temp: +125°C; Height: 1.8mm; Package: AMS1117; Device Class L2: Power Management ICs; ComponentLink2Description: Datasheet; ComponentLink2URL: http://www.advanced-monolithic.com/pdf/ds1117.pdf; Category: IC; RoHS: TRUE; Automotive: No; Device Class L1: Integrated Circuits (ICs); Output Current: 1A; Device Class L3: Voltage Regulators - Linear; Temperature: -40°C to +125°C; Output Voltage: 3.3V; Manufacturer Part Number: AMS1117-3.3; Temperature Range Low: -40°C; Octopart: https://octopart.com/ams1117-3.3-advanced+monolithic+systems-25899300; Lead Free: Yes; Ipc Land Pattern Name: SOT229P700X180-4; Temperature Range High: +125°C
U4 = CMP-209535-000001-1: LDO Voltage Regulators 1A, 3.3V; Manufacturer Part Number: AMS1117-3.3; Manufacturer: Advanced Monolithic Systems; Dropout Voltage: 1.1V; Output Type: Fixed; Nominal Supply Current: 5mA; Max Power Dissipation: 1.2W; Max Supply Voltage: 15V; Number Of Outputs: 1; Standoff Height: 0.64mm; Max Junction Temp: +125°C; Height: 1.8mm; Package: AMS1117; Device Class L2: Power Management ICs; ComponentLink2Description: Datasheet; ComponentLink2URL: http://www.advanced-monolithic.com/pdf/ds1117.pdf; Category: IC; RoHS: TRUE; Automotive: No; Device Class L1: Integrated Circuits (ICs); Output Current: 1A; Device Class L3: Voltage Regulators - Linear; Temperature: -40°C to +125°C; Output Voltage: 3.3V; Temperature Range Low: -40°C; Octopart: https://octopart.com/ams1117-3.3-advanced+monolithic+systems-25899300; Lead Free: Yes; Ipc Land Pattern Name: SOT229P700X180-4; Temperature Range High: +125°C
U5 = SGM2019: SGM2019 Regulator / Low Power, Low Dropout, / RF-Linear Regulators / TSOT-23 T/R; MP: LT1761ES5-5#TRPBF; MF: Analog Devices; SnapEDA_Link: https://www.snapeda.com/parts/LT1761ES5-5%23TRPBF/Analog%20Devices/view-part/4345495/?ref=snap; Package: SOT-23-5 Analog Devices; Mouser-Purchase-URL: https://snapeda.com/shop?store=Mouser&id=4345495; Arrow_Electronics-Purchase-URL: https://snapeda.com/shop?store=Arrow+Electronics&id=4345495; Digi-Key_Part_Number: LT1761ES5-5#TRPBFCT-ND; DigiKey-Purchase-URL: https://snapeda.com/shop?store=DigiKey&id=4345495; Value: *
X1 = Phoenix MKDSN 02: DatasheetVersion: 2021; ComponentLink1Description: Website Smart World; ComponentLink1URL: https://www.smartw.ir/; ComponentLink2Description: Telegram; ComponentLink2URL: https://t.me/altium_smartw; ComponentLink3Description: Instagram; ComponentLink3URL: https://Instagram.com/smartgw.ir